# EAGLE design battiny_power_module (EAGLE 9.6.2)
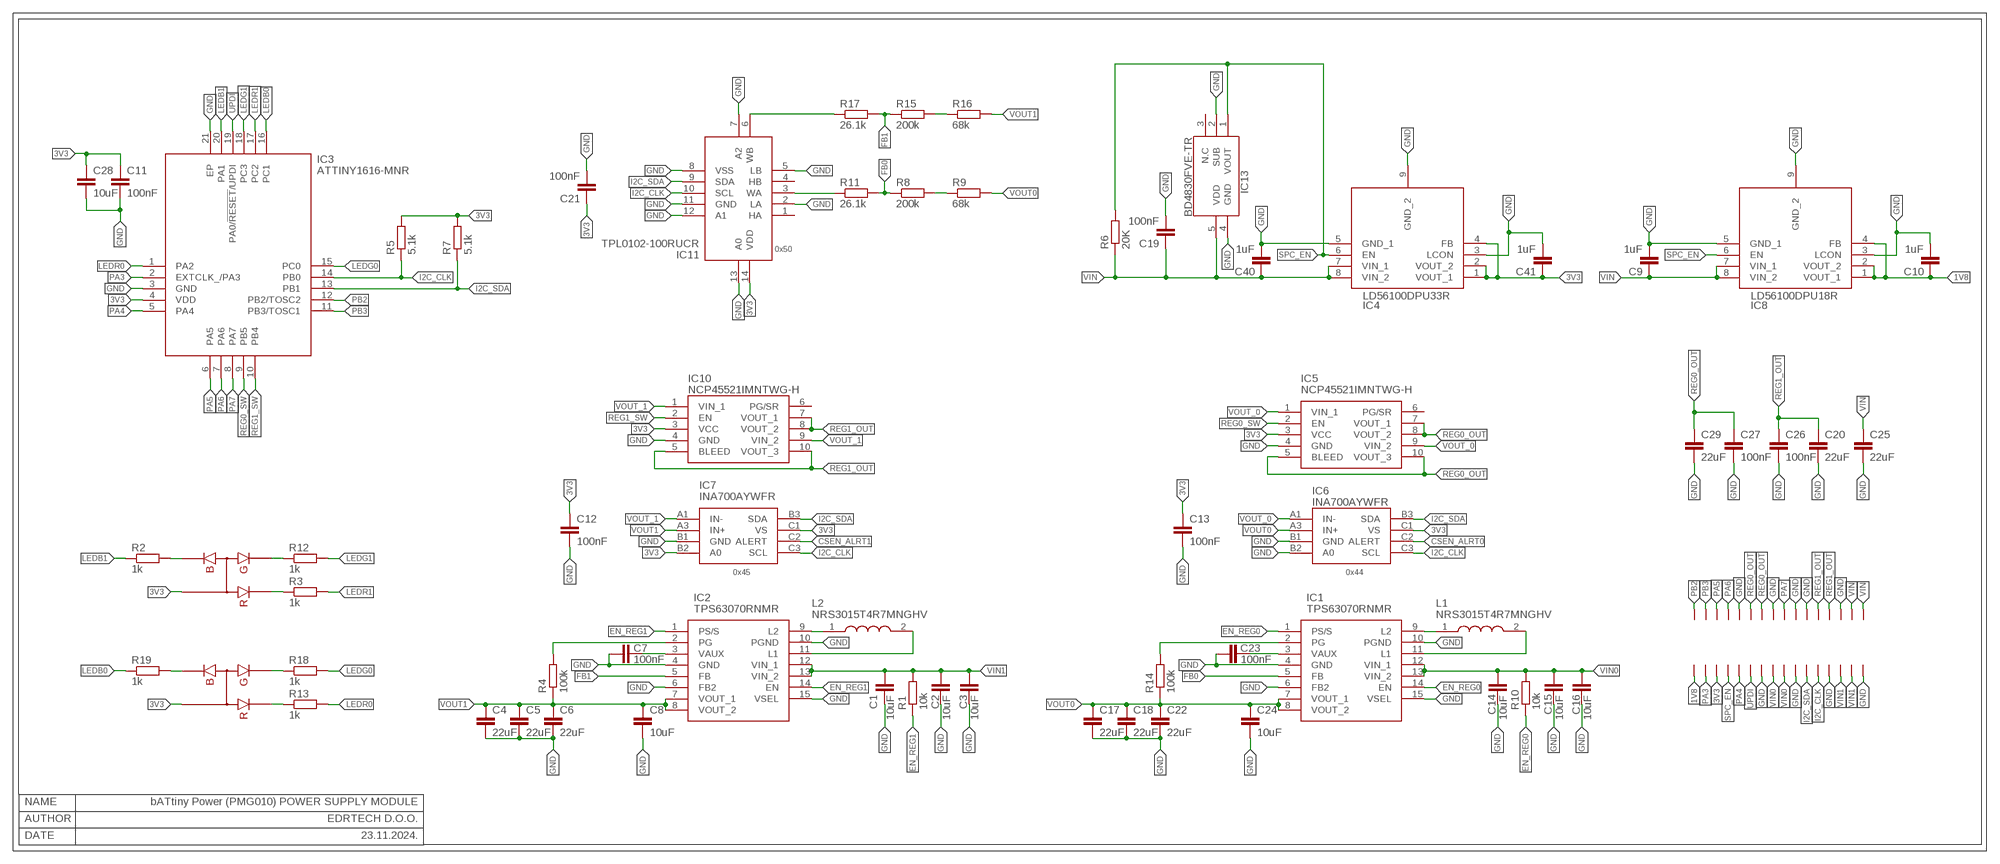
[diagram p0: schematic, sheet 1]

## Parts
C1  10uF  C-EUC0402  [C0402]
C2  10uF  C-EUC0402  [C0402]
C3  10uF  C-EUC0402  [C0402]
C4  22uF  C-EUC0603  [C0603]
C5  22uF  C-EUC0603  [C0603]
C6  22uF  C-EUC0603  [C0603]
C7  100nF  C-EUHPC0201  [HPC0201]
C8  10uF  C-EUC0402  [C0402]
C9  1uF  C-EUC0201  [C0201]
C10  1uF  C-EUC0201  [C0201]
C11  100nF  C-EUC0201  [C0201]
C12  100nF  C-EUC0201  [C0201]
C13  100nF  C-EUC0201  [C0201]
C14  10uF  C-EUC0402  [C0402]
C15  10uF  C-EUC0402  [C0402]
C16  10uF  C-EUC0402  [C0402]
C17  22uF  C-EUC0603  [C0603]
C18  22uF  C-EUC0603  [C0603]
C19  100nF  C-EUC0201  [C0201]
C20  22uF  C-EUC0805K  [C0805K]
C21  100nF  C-EUC0201  [C0201]
C22  22uF  C-EUC0603  [C0603]
C23  100nF  C-EUHPC0201  [HPC0201]
C24  10uF  C-EUC0402  [C0402]
C25  22uF  C-EUC0805K  [C0805K]
C26  100nF  C-EUC0603  [C0603]
C27  100nF  C-EUC0603  [C0603]
C28  10uF  C-EUC0402  [C0402]
C29  22uF  C-EUC0805K  [C0805K]
C40  1uF  C-EUC0201  [C0201]
C41  1uF  C-EUC0201  [C0201]
IC1  TPS63070RNMR  [TPS630701RNMR]
IC2  TPS63070RNMR  [TPS630701RNMR]
IC3  ATTINY1616-MNR  [QFN40P300X300X90-21N]
IC4  LD56100DPU30R  [SON40P120X160X50-9N]
IC5  NCP45521IMNTWG-H  [NCP45521]
IC6  INA700AYWFR  [INA700AYWFR]
IC7  INA700AYWFR  [INA700AYWFR]
IC8  LD56100DPU30R  [SON40P120X160X50-9N]
IC10  NCP45521IMNTWG-H  [NCP45521]
IC11  TPL0102-100RUCR  [QFN40P200X200X40-14N]
IC13  BD4830FVE-TR  [SOTFL50P160X60-5N]
L1  NRS3015T4R7MNGHV  [NRS3015T4R7MNGHV]
L2  NRS3015T4R7MNGHV  [NRS3015T4R7MNGHV]
R1  10k  R-EU_R0201  [R0201]
R2  1k  R-EU_R0201  [R0201]
R3  1k  R-EU_R0201  [R0201]
R4  100k  R-EU_R0201  [R0201]
R5  5.1k  R-EU_R0201  [R0201]
R6  20K  R-EU_R0201  [R0201]
R7  5.1k  R-EU_R0201  [R0201]
R8  200k  R-EU_R0201  [R0201]
R9  68k  R-EU_R0201  [R0201]
R10  10k  R-EU_R0201  [R0201]
R11  26.1k  R-EU_R0201  [R0201]
R12  1k  R-EU_R0201  [R0201]
R13  1k  R-EU_R0201  [R0201]
R14  100k  R-EU_R0201  [R0201]
R15  200k  R-EU_R0201  [R0201]
R16  68k  R-EU_R0201  [R0201]
R17  26.1k  R-EU_R0201  [R0201]
R18  1k  R-EU_R0201  [R0201]
R19  1k  R-EU_R0201  [R0201]
U$1  1.27_CH_16P  [1.27_CH_16P]
U$2  1.27_CH_16P  [1.27_CH_16P]
U$3  XL-B1010RGBT-HF  [TBA-C1010MB-J2I16]
U$4  XL-B1010RGBT-HF  [TBA-C1010MB-J2I16]

## Nets
1V8: C10.1 IC8.1(VOUT_1) IC8.2(VOUT_2) IC8.4(FB) U$2.P$32 U$2.P$48
3V3: C11.1 C12.1 C13.1 C21.1 C28.1 C41.1 IC3.4(VDD) IC4.1(VOUT_1) IC4.2(VOUT_2) IC4.4(FB) IC5.3(VCC) IC6.C1(VS) IC7.B2(A0) IC7.C1(VS) IC10.3(VCC) IC11.14(VDD) R5.2 R7.2 U$2.P$30 U$2.P$46 U$3.P$3 U$4.P$3
CSEN_ALRT0: IC6.C2(ALERT)
CSEN_ALRT1: IC7.C2(ALERT)
EN_REG0: IC1.1(PS/S) IC1.14(EN) R10.1
EN_REG1: IC2.1(PS/S) IC2.14(EN) R1.1
FB0: IC1.5(FB) R8.1 R11.2
FB1: IC2.5(FB) R15.1 R17.2
GND: C1.2 C2.2 C3.2 C4.2 C5.2 C6.2 C7.1 C8.2 C9.2 C10.2 C11.2 C12.2 C13.2 C14.2 C15.2 C16.2 C17.2 C18.2 C19.2 C20.2 C21.2 C22.2 C23.1 C24.2 C25.2 C26.2 C27.2 C28.2 C29.2 C40.2 C41.2 IC1.4(GND) IC1.6(FB2) IC1.10(PGND) IC1.15(VSEL) IC2.4(GND) IC2.6(FB2) IC2.10(PGND) IC2.15(VSEL) IC3.3(GND) IC3.21(EP) IC4.3(LCON) IC4.5(GND_1) IC4.9(GND_2) IC5.4(GND) IC6.B1(GND) IC6.B2(A0) IC7.B1(GND) IC8.3(LCON) IC8.5(GND_1) IC8.9(GND_2) IC10.4(GND) IC11.2(LA) IC11.5(LB) IC11.7(A2) IC11.8(VSS) IC11.11(GND) IC11.12(A1) IC11.13(A0) IC13.2(SUB) IC13.4(GND) U$1.P$21 U$1.P$24 U$1.P$26 U$1.P$27 U$1.P$30 U$1.P$37 U$1.P$40 U$1.P$42 U$1.P$43 U$1.P$46 U$2.P$17 U$2.P$20 U$2.P$23 U$2.P$26 U$2.P$33 U$2.P$36 U$2.P$39 U$2.P$42
I2C_CLK: IC3.14(PB0) IC6.C3(SCL) IC7.C3(SCL) IC11.10(SCL) R5.1 U$2.P$21 U$2.P$37
I2C_SDA: IC3.13(PB1) IC6.B3(SDA) IC7.B3(SDA) IC11.9(SDA) R7.1 U$2.P$22 U$2.P$38
LEDB0: IC3.16(PC1) R19.1
LEDB1: IC3.20(PA1) R2.1
LEDG0: IC3.15(PC0) R18.2
LEDG1: IC3.18(PC3) R12.2
LEDR0: IC3.1(PA2) R13.2
LEDR1: IC3.17(PC2) R3.2
N$1: IC2.9(L2) L2.1
N$2: IC2.11(L1) L2.2
N$4: C7.2 IC2.3(VAUX)
N$5: R8.2 R9.1
N$6: IC2.2(PG) R4.2
N$7: R2.2 U$4.P$1
N$8: R15.2 R16.1
N$10: IC1.9(L2) L1.1
N$11: R3.1 U$4.P$4
N$12: IC1.11(L1) L1.2
N$26: C23.2 IC1.3(VAUX)
N$27: IC1.2(PG) R14.2
N$36: R12.1 U$4.P$2
N$46: R13.1 U$3.P$4
N$47: R18.1 U$3.P$2
N$48: R19.2 U$3.P$1
N$54: IC11.6(WB) R17.1
N$57: IC11.3(WA) R11.1
PA3: IC3.2(EXTCLK_/PA3) U$2.P$31 U$2.P$47
PA4: IC3.5(PA4) U$2.P$28 U$2.P$44
PA5: IC3.6(PA5) U$1.P$19 U$1.P$35
PA6: IC3.7(PA6) U$1.P$20 U$1.P$36
PA7: IC3.8(PA7) U$1.P$25 U$1.P$41
PB2: IC3.12(PB2/TOSC2) U$1.P$17 U$1.P$33
PB3: IC3.11(PB3/TOSC1) U$1.P$18 U$1.P$34
REG0_OUT: C27.1 C29.1 IC5.5(BLEED) IC5.7(VOUT_1) IC5.8(VOUT_2) IC5.10(VOUT_3) U$1.P$22 U$1.P$23 U$1.P$38 U$1.P$39
REG0_SW: IC3.9(PB5) IC5.2(EN)
REG1_OUT: C20.1 C26.1 IC10.5(BLEED) IC10.7(VOUT_1) IC10.8(VOUT_2) IC10.10(VOUT_3) U$1.P$28 U$1.P$29 U$1.P$44 U$1.P$45
REG1_SW: IC3.10(PB4) IC10.2(EN)
SPC_EN: IC4.6(EN) IC8.6(EN) IC13.1(VOUT) R6.2 U$2.P$29 U$2.P$45
UPDI: IC3.19(PA0/!RESET!/UPDI) U$2.P$27 U$2.P$43
VIN: C9.1 C19.1 C25.1 C40.1 IC4.7(VIN_1) IC4.8(VIN_2) IC8.7(VIN_1) IC8.8(VIN_2) IC13.5(VDD) R6.1 U$1.P$31 U$1.P$32 U$1.P$47 U$1.P$48
VIN0: C14.1 C15.1 C16.1 IC1.12(VIN_1) IC1.13(VIN_2) R10.2 U$2.P$24 U$2.P$25 U$2.P$40 U$2.P$41
VIN1: C1.1 C2.1 C3.1 IC2.12(VIN_1) IC2.13(VIN_2) R1.2 U$2.P$18 U$2.P$19 U$2.P$34 U$2.P$35
VOUT0: C17.1 C18.1 C22.1 C24.1 IC1.7(VOUT_1) IC1.8(VOUT_2) IC6.A3(IN+) R9.2 R14.1
VOUT1: C4.1 C5.1 C6.1 C8.1 IC2.7(VOUT_1) IC2.8(VOUT_2) IC7.A3(IN+) R4.1 R16.2
VOUT_0: IC5.1(VIN_1) IC5.9(VIN_2) IC6.A1(IN-)
VOUT_1: IC7.A1(IN-) IC10.1(VIN_1) IC10.9(VIN_2)
Unconnected: IC5.6(PG/SR) IC10.6(PG/SR) IC11.1(HA) IC11.4(HB) IC13.3(N.C)

## Notes on the sheet
- 0x50
- LD56100DPU33R | LD56100DPU18R
- 0x45 | 0x44
- NAME | bATtiny Power (PMG010) POWER SUPPLY MODULE
- AUTHOR | EDRTECH D.O.O.
- DATE | 23.11.2024.

## Library data of the parts
C1-C29 C40 C41 = rcl:C-EU: CAPACITOR, European symbol; SPICEPREFIX: C
IC1 IC2 = edrtech_lib:TPS63070RNMR: Wide Input Voltage (2V-16V) Buck-Boost Converter Source: Datasheet <http://www.ti.com/lit/gpn/tps63070>; ARROW_PART_NUMBER: TPS63070RNMR; ARROW_PRICE-STOCK: https://www.arrow.com/en/products/tps63070rnmr/texas-instruments?region=nac; DESCRIPTION: Wide Input Voltage (2V-16V) Buck-Boost Converter; HEIGHT: mm; MANUFACTURER_NAME: Texas Instruments; MANUFACTURER_PART_NUMBER: TPS63070RNMR; MOUSER_PART_NUMBER: 595-TPS63070RNMR; MOUSER_PRICE-STOCK: https://www.mouser.co.uk/ProductDetail/Texas-Instruments/TPS63070RNMR?qs=LuYMPh7GGMS51GHntBDRnQ%3D%3D
IC3 = edrtech_lib:ATTINY1616-MNR: Microchip ATTINY1616-MNR, 8bit AVR Microcontroller, 20MHz, 16 kB Flash, 20-Pin VQFN Source: Datasheet <https://datasheet.datasheetarchive.com/originals/distributors/DKDS41/DSANUWW0026757.pdf>; ARROW_PART_NUMBER: ATTINY1616-MNR; ARROW_PRICE-STOCK: https://www.arrow.com/en/products/attiny1616-mnr/microchip-technology?region=nac; DESCRIPTION: Microchip ATTINY1616-MNR, 8bit AVR Microcontroller, 20MHz, 16 kB Flash, 20-Pin VQFN; HEIGHT: 0.9mm; MANUFACTURER_NAME: Microchip; MANUFACTURER_PART_NUMBER: ATTINY1616-MNR; MOUSER_PART_NUMBER: 556-ATTINY1616MNR; MOUSER_PRICE-STOCK: https://www.mouser.co.uk/ProductDetail/Microchip-Technology/ATTINY1616-MNR?qs=HXFqYaX1Q2yKNpuKQU9qww%3D%3D
IC4 IC8 = edrtech_lib:LD56100DPU30R: LDO Voltage Regulators POWER MANAGEMENT Source: Datasheet <https://componentsearchengine.com/Datasheets/1/LD56100DPU30R.pdf>; ARROW_PART_NUMBER: LD56100DPU30R; ARROW_PRICE-STOCK: https://www.arrow.com/en/products/ld56100dpu30r/stmicroelectronics?region=nac; DESCRIPTION: LDO Voltage Regulators POWER MANAGEMENT; HEIGHT: 0.5mm; MANUFACTURER_NAME: STMicroelectronics; MANUFACTURER_PART_NUMBER: LD56100DPU30R; MOUSER_PART_NUMBER: 511-LD56100DPU30R; MOUSER_PRICE-STOCK: https://www.mouser.co.uk/ProductDetail/STMicroelectronics/LD56100DPU30R?qs=rrS6PyfT74cpfJYuxhTQmg%3D%3D
IC5 IC10 = edrtech_lib:NCP45521IMNTWG-H: ON Semiconductor NCP45521IMNTWG-H, 1 Power Switch IC, High Side 8-Pin, DFN Source: Datasheet <http://www.onsemi.com/pub/Collateral/NCP45520-D.PDF>; ARROW_PART_NUMBER: NCP45521IMNTWG-H; ARROW_PRICE-STOCK: https://www.arrow.com/en/products/ncp45521imntwg-h/on-semiconductor?region=nac; DESCRIPTION: ON Semiconductor NCP45521IMNTWG-H, 1 Power Switch IC, High Side 8-Pin, DFN; HEIGHT: 1mm; MANUFACTURER_NAME: onsemi; MANUFACTURER_PART_NUMBER: NCP45521IMNTWG-H; MOUSER_PART_NUMBER: 863-NCP45521IMNTWG-H; MOUSER_PRICE-STOCK: https://www.mouser.co.uk/ProductDetail/onsemi/NCP45521IMNTWG-H?qs=72ObqG5T4UZ6w73ghQANGg%3D%3D
IC6 IC7 = edrtech_lib:INA700AYWFR: Current & Power Monitors & Regulators 40-V16-BitIC output digital power monitor in WCSP withEZShunt Technology 8-DSBGA -40 to 125 Source: Datasheet <https://www.ti.com/lit/ds/symlink/ina700.pdf?ts=1715161211623&ref_url=https%3A%2F%2Fwww.ti.com%2Fproduct%2FINA700%2Fpart-details%2FINA700AYWFR>; DESCRIPTION: Current & Power Monitors & Regulators 40-V16-BitIC output digital power monitor in WCSP withEZShunt Technology 8-DSBGA -40 to 125; HEIGHT: 0.3mm; MANUFACTURER_NAME: Texas Instruments; MANUFACTURER_PART_NUMBER: INA700AYWFR
IC11 = edrtech_lib:TPL0102-100RUCR: 256-Taps Dual-Channel Digital Potentiometer With I2C Interface and Nonvolatile Memory Source: Datasheet <http://www.ti.com/lit/ds/symlink/tpl0102-100.pdf>; ARROW_PART_NUMBER: TPL0102-100RUCR; ARROW_PRICE-STOCK: https://www.arrow.com/en/products/tpl0102-100rucr/texas-instruments?region=nac; DESCRIPTION: 256-Taps Dual-Channel Digital Potentiometer With I2C Interface and Nonvolatile Memory; HEIGHT: 0.4mm; MANUFACTURER_NAME: Texas Instruments; MANUFACTURER_PART_NUMBER: TPL0102-100RUCR
IC13 = BD4830FVE-TR:BD4830FVE-TR: ROHM BD4830FVE-TR, Voltage Detector 5-Pin, VSOF Source: Datasheet <https://componentsearchengine.com/Datasheets/1/BD4830FVE-TR.pdf>; DESCRIPTION: ROHM BD4830FVE-TR, Voltage Detector 5-Pin, VSOF; HEIGHT: 0.6mm; MANUFACTURER_NAME: ROHM Semiconductor; MANUFACTURER_PART_NUMBER: BD4830FVE-TR; MOUSER_PART_NUMBER: 755-BD4830FVE-TR; MOUSER_PRICE-STOCK: https://www.mouser.co.uk/ProductDetail/ROHM-Semiconductor/BD4830FVE-TR?qs=4kLU8WoGk0tBHsO2oOYuSw%3D%3D
L1 L2 = edrtech_lib:NRS3015T4R7MNGHV: Fixed Inductors 3015 4.7uH 144mOhms +/-20%Tol 1.02A Q200 Source: Datasheet <https://datasheet.datasheetarchive.com/originals/distributors/Datasheets-DGA11/2208534.pdf>; ARROW_PART_NUMBER: NRS3015T4R7MNGHV; ARROW_PRICE-STOCK: null?region=nac; DESCRIPTION: Fixed Inductors 3015 4.7uH 144mOhms +/-20%Tol 1.02A Q200; HEIGHT: 1.5mm; MANUFACTURER_NAME: TAIYO YUDEN; MANUFACTURER_PART_NUMBER: NRS3015T4R7MNGHV; MOUSER_PART_NUMBER: 963-NRS3015T4R7MNGHV; MOUSER_PRICE-STOCK: https://www.mouser.co.uk/ProductDetail/TAIYO-YUDEN/NRS3015T4R7MNGHV?qs=DpxmIIQLg%252BO42hcBUV1Thg%3D%3D
R1-R19 = rcl:R-EU_: RESISTOR, European symbol; SPICEPREFIX: R
U$1 U$2 = edrtech_lib:1.27_CH_16P
U$3 U$4 = edrtech_lib:XL-B1010RGBT-HF

## Board
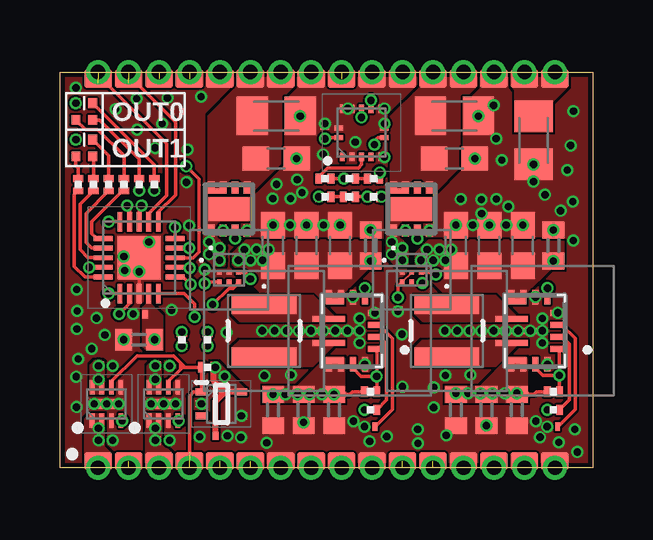
[diagram p1: board, top side]
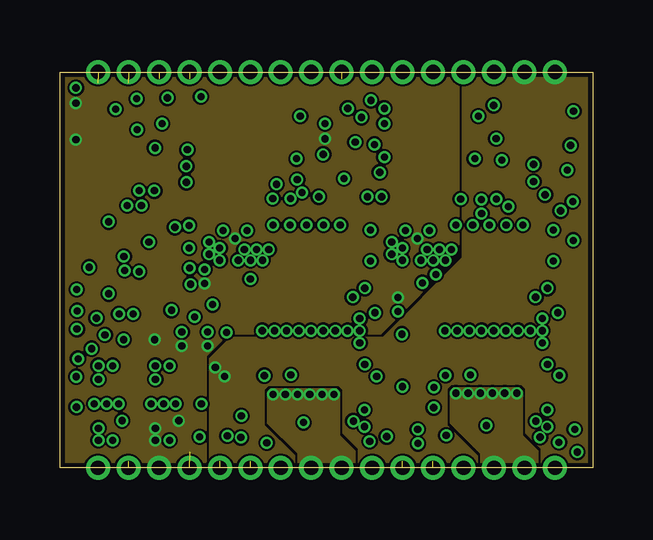
[diagram p2: board, inner layer Route2]
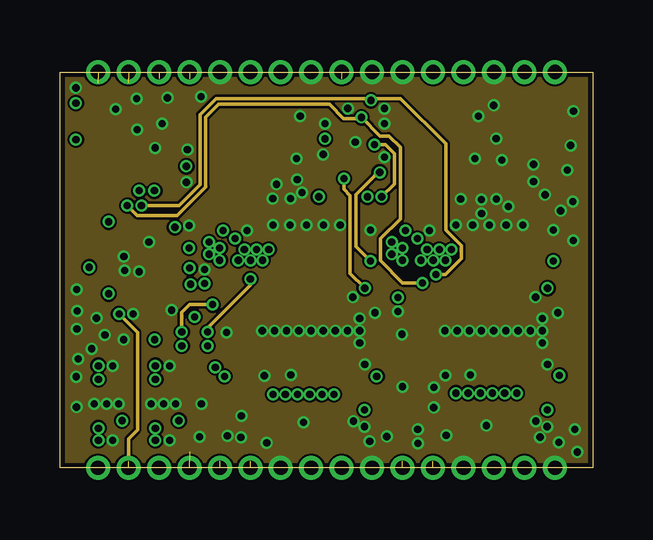
[diagram p3: board, inner layer Route3]
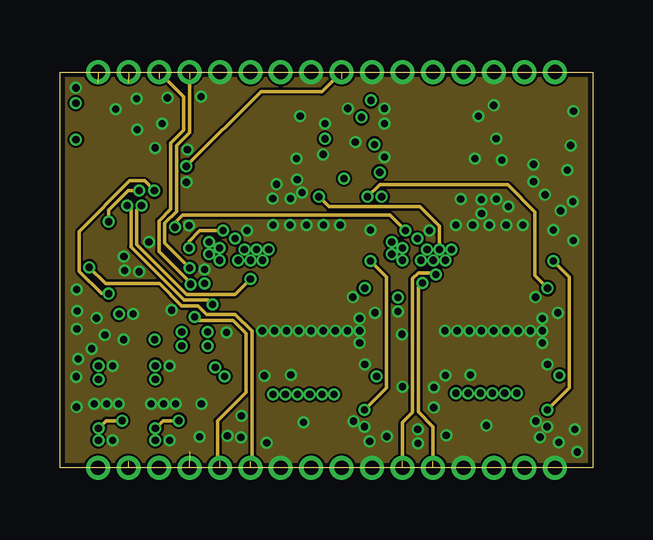
[diagram p4: board, inner layer Route14]
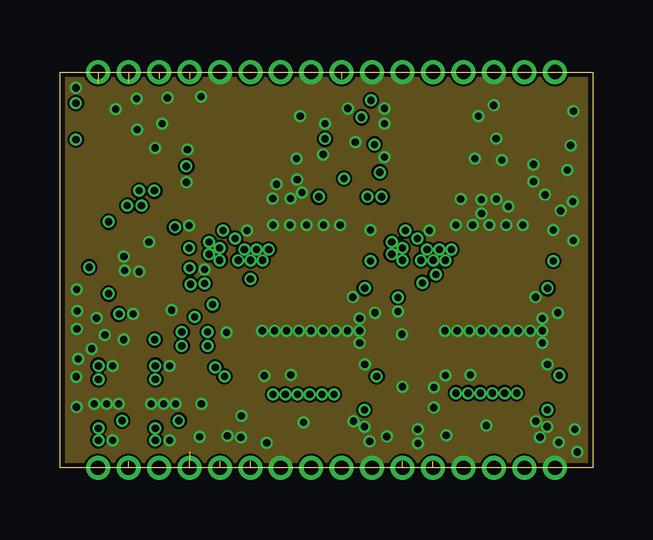
[diagram p5: board, inner layer Route15]
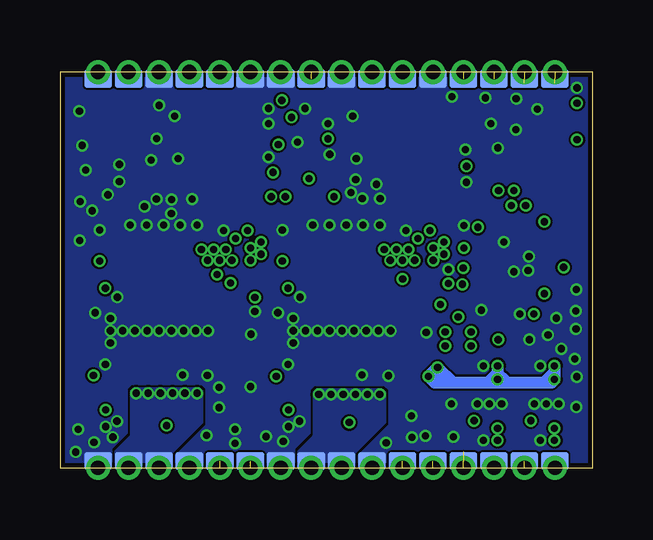
[diagram p6: board, bottom side, seen from below]

Size 22.23 x 16.51 mm. Coordinates in mm from the lower left corner, seen from the top.
Outline: 0,0 0,16.51 22.23,16.51 22.23,0 0,0
Copper layers (1+2*3+14*15+16): Top 0.035mm / dielectric 0.0994mm / Route2 0.0152mm / dielectric 0.55mm / Route3 0.0152mm / dielectric 0.1088mm / Route14 0.0152mm / dielectric 0.55mm / Route15 0.0152mm / dielectric 0.0994mm / Bottom 0.035mm
Design rules "jlcpcb-6layers_edrtech *": minimum track width 3.5mil, minimum drill 0.2mm, track to track 3.5mil, track to pad 3.5mil, pad to pad 3.5mil, via to via 3.5mil, smd to smd 0mil, copper to edge 0.2mm, drill to drill 6mil, minimum pad ring 0.1mm, minimum via ring 0.1mm, stop-mask expansion 2mil, vias tented up to drill 25mil, thermal gap 10mil

### Footprints (pad centres in the part's own frame; a part is rotated, then mirrored left to right if it is on the bottom)
C0402 = smd 0.7 x 0.9: 1 -0.65,0; 2 0.65,0
C0603 = smd 1.1 x 1: 1 -0.85,0; 2 0.85,0
HPC0201 = smd 0.2 x 0.35: 1 -0.18,0; 2 0.18,0
C0201 = smd 0.25 x 0.35: 1 -0.25,0; 2 0.25,0
C0805K = smd 1.3 x 1.6: 1 -1,0; 2 1,0
TPS630701RNMR = smd 0.6 x 0.25: 1 -0.438,0.75; 2 -0.438,0.25; 3 -0.438,-0.25; 4 -0.438,-0.75 | smd 0.25 x 0.6: 5 -0.012,-1.4; 6 0.488,-1.4; 7 0.988,-1.4; 8 1.488,-1.4; 12 1.488,1.4; 13 0.988,1.4; 14 0.488,1.4; 15 -0.012,1.4 | smd 1.35 x 0.25: 9 1.488,-0.5; 11 1.488,0.5 | smd 1.7 x 0.25: 10 1.313,0 | smd 0.25 x 0.25: 16 1.238,1.225; 17 1.238,-1.225
QFN40P300X300X90-21N = smd 0.8 x 0.2: 1 -1.5,0.8; 2 -1.5,0.4; 3 -1.5,0; 4 -1.5,-0.4; 5 -1.5,-0.8; 11 1.5,-0.8; 12 1.5,-0.4; 13 1.5,0; 14 1.5,0.4; 15 1.5,0.8 | smd 0.2 x 0.8: 6 -0.8,-1.5; 7 -0.4,-1.5; 8 0,-1.5; 9 0.4,-1.5; 10 0.8,-1.5; 16 0.8,1.5; 17 0.4,1.5; 18 0,1.5; 19 -0.4,1.5; 20 -0.8,1.5 | smd 1.8 x 1.8: 21 0,0
SON40P120X160X50-9N = smd 0.6 x 0.2: 1 -0.7,0.6; 2 -0.7,0.2; 3 -0.7,-0.2; 4 -0.7,-0.6; 5 0.7,-0.6; 6 0.7,-0.2; 7 0.7,0.2; 8 0.7,0.6 | smd 0.4 x 1.4: 9 0,0
NCP45521 = smd 0.3 x 0.5: 1 -0.75,-0.9; 2 -0.25,-0.9; 3 0.25,-0.9; 4 0.75,-0.9; 5 0.75,0.9; 6 0.25,0.9; 7 -0.25,0.9; 8 -0.75,0.9 | smd 1.7 x 1: 9 0,0 | smd 0.195 x 0.2: 10 -0.5,0.75
INA700AYWFR = smd 0.3 x 0.404: A1 -0.387,0.4; A3 0.387,0.4 | smd 0.2 x 0.2: B1 -0.4,-0.102; B2 0,-0.102; B3 0.4,-0.102; C1 -0.4,-0.502; C2 0,-0.502; C3 0.4,-0.502
QFN40P200X200X40-14N = smd 0.35 x 0.2: 1 -1,0.8; 2 -1,0.4; 3 -1,0; 4 -1,-0.4; 5 -1,-0.8; 8 1,-0.8; 9 1,-0.4; 10 1,0; 11 1,0.4; 12 1,0.8 | smd 0.2 x 0.35: 6 -0.2,-0.95; 7 0.2,-0.95; 13 0.2,0.95; 14 -0.2,0.95
SOTFL50P160X60-5N = smd 0.465 x 0.3: 1 -0.832,0.5; 2 -0.832,0; 3 -0.832,-0.5; 4 0.832,-0.5; 5 0.832,0.5
NRS3015T4R7MNGHV = smd 0.8 x 2.7: 1 -1.1,0; 2 1.1,0
R0201 = smd 0.28 x 0.43: 1 -0.255,0; 2 0.255,0
1.27_CH_16P = smd 1.15 x 0.762: P$17 -9.525,-0.279; P$18 -8.255,-0.279; P$19 -6.985,-0.279; P$20 -5.715,-0.279; P$21 -4.445,-0.279; P$22 -3.175,-0.279; P$23 -1.905,-0.279; P$24 -0.635,-0.279; P$25 0.635,-0.279; P$26 1.905,-0.279; P$27 3.175,-0.279; P$28 4.445,-0.279; P$29 5.715,-0.279; P$30 6.985,-0.279; P$31 8.255,-0.279; P$32 9.525,-0.279 | smd 1.15 x 0.762 bottom: P$33 -9.525,-0.279; P$34 -8.255,-0.279; P$35 -6.985,-0.279; P$36 -5.715,-0.279; P$37 -4.445,-0.279; P$38 -3.175,-0.279; P$39 -1.905,-0.279; P$40 -0.635,-0.279; P$41 0.635,-0.279; P$42 1.905,-0.279; P$43 3.175,-0.279; P$44 4.445,-0.279; P$45 5.715,-0.279; P$46 6.985,-0.279; P$47 8.255,-0.279; P$48 9.525,-0.279
TBA-C1010MB-J2I16 = smd 0.4 x 0.4: P$1 -0.35,0.35; P$2 -0.35,-0.35; P$3 0.35,0.35; P$4 0.35,-0.35

### Placement (x,y rotation side)
C1  16.51,2.41 270 top
C2  17.78,2.41 270 top
C3  19.05,2.41 270 top
C4  16.51,9.27 90 top
C5  19.3,9.27 90 top
C6  17.91,9.27 90 top
C7  20.57,1.71 0 top
C8  20.57,9.27 90 top
C9  1.94,4.25 0 top
C10  1.94,1.14 0 top
C11  3.3,6.41 180 top
C12  14.1,6.86 270 top
C13  6.03,7.94 90 top
C14  8.89,2.41 270 top
C15  10.16,2.41 270 top
C16  11.43,2.41 270 top
C17  10.29,9.27 90 top
C18  8.89,9.27 90 top
C19  6.73,1.33 0 top
C20  16.45,14.67 0 top
C21  11.05,13.97 90 top
C22  11.68,9.27 90 top
C23  12.95,1.71 0 top
C24  12.95,9.27 90 top
C25  19.75,13.65 270 top
C26  16.45,12.89 0 top
C27  9.02,12.89 0 top
C28  3.3,5.35 180 top
C29  9.02,14.67 0 top
C40  4.32,4.25 0 top
C41  4.32,1.14 0 top
IC1  12.7,5.71 180 top
IC2  20.32,5.71 180 top
IC3  3.3,8.76 90 top
IC4  4.32,2.67 90 top
IC5  7.05,10.79 0 top
IC6  7.05,8.26 0 top
IC7  14.67,8.26 0 top
IC8  1.94,2.67 90 top
IC10  14.66,10.79 0 top
IC11  12.57,13.97 90 top
IC13  6.73,2.67 0 top
L1  8.51,5.71 270 top
L2  16.13,5.71 270 top
R1  20.57,3.17 180 top
R2  0.76,11.81 90 top
R3  2.03,11.81 270 top
R4  20.57,2.41 0 top
R5  5.08,5.33 270 top
R6  6.16,4.19 180 top
R7  6.16,5.33 270 top
R8  12.06,12.06 0 top
R9  13.08,12.06 0 top
R10  12.95,3.17 180 top
R11  11.05,12.06 0 top
R12  1.4,11.81 270 top
R13  3.94,11.81 270 top
R14  12.95,2.41 0 top
R15  12.06,11.3 180 top
R16  11.05,11.3 180 top
R17  13.08,11.3 180 top
R18  3.3,11.81 270 top
R19  2.67,11.81 90 top
U$1  11.11,16.51 0 top
U$2  11.11,0 180 top
U$3  1.02,14.86 90 top
U$4  1.02,13.34 90 top

### Tracks (layer width: path | path; a pad name or v marks a point on that pad's centre or on a via)
1V8  (via drill 0.3 pad 0.4, 0.6 pad 1)
  Top 0.152: C10.1 v1.6,1.14 | IC8.4 v2.59,1.97
  Route14 0.152: v2.59,1.97 1.92,1.97 v1.6,1.65
  other vias: 1.59,0
  pour Top (no thermals): 1.24,2.27 1.01,2.04 1.01,0 2.16,0 2.16,0.6 1.85,0.9 1.85,2.27
3V3  (via drill 0.3 pad 0.4, 0.6 pad 1)
  Top 0.102: IC7.B2 IC7.C1
  Top 0.152: C41.1 v3.98,1.14 | IC4.4 v4.96,1.97 | IC5.3 v7.3,9.56 | IC10.3 v14.91,9.56 | IC7.C1 14.1,7.58 C12.1 | C13.1 6.1,7.75 IC6.C1 | IC11.14 11.1,13.77 C21.1
  Route14 0.152: v4.96,1.97 4.29,1.97 v3.98,1.65
  other vias: 3.95,5.35 6.16,5.08 5.08,5.08 6.03,7.69 14.1,7.11 11.05,13.72 0.67,15.21 0.67,13.69 4.13,0
  pour Top (no thermals): 3.61,2.29 4.22,2.29 4.27,2.24 4.27,1.04 4.7,0.61 4.7,0.58 4.72,0.56 4.72,0 3.56,0 3.56,2.24
  pour Route2 (rank 6, no thermals): 0,0 0,16.51 22.23,16.51 22.23,0
  pour Top (no thermals): 3.6,4.9 3.43,5.07 3.43,6.69 3.6,6.86 3.6,7.66 3.8,7.66 3.8,6.86 4.3,6.36 4.3,4.9
EN_REG0  (via drill 0.3 pad 0.4)
  Top 0.152: IC1.14 12.21,4.16 12.56,3.81 v13.21,3.81 | v13.21,3.81 R10.1 | IC1.1 13.21,4.89 v13.21,3.81
EN_REG1  (via drill 0.3 pad 0.4)
  Top 0.152: IC2.14 19.83,4.16 20.14,3.85 v20.83,3.85 | v20.83,3.85 R1.1 | v20.83,3.85 20.83,4.89 IC2.1
FB0  (via drill 0.3 pad 0.4)
  Top 0.152: IC1.5 v12.71,7.49 | v11.84,12.06 R8.1 R11.2
  Route3 0.152: v12.71,7.49 12.1,8.11 12.1,11.36 11.84,11.62 v11.84,12.06
FB1  (via drill 0.3 pad 0.4)
  Top 0.152: R15.1 R17.2 | IC2.5 v20.33,7.49
  Route14 0.152: v20.33,7.49 19.81,8.01 19.81,10.67 18.67,11.81 13.34,11.81 R17.2
  other vias: 12.83,11.3
GND  (via drill 0.3 pad 0.4, 0.6 pad 1)
  Top 0.152: IC3.3 IC3.21 | C12.2 v14.1,6.52 | C13.2 v6.03,8.28 | IC1.10 v12.5,5.71 | C7.1 v20.32,1.71 | C23.1 v12.7,1.71
  other vias: 3.05,6.41 2.65,5.35 10.02,14.67 9.87,12.89 11.05,14.35 12,14.99 13.53,14.35 13.53,14.99 13.53,12.95 17.45,14.67 17.3,12.89 19.75,12.65 7.8,9.89 8.89,10.12 10.29,10.12 11.68,10.12 12.95,9.92 15.41,9.89 16.51,10.12 17.91,10.12 19.3,10.12 20.57,9.92 12.21,7.12 13.14,6.46 12.71,4.32 11.99,5.71 11.48,5.71 10.98,5.71 10.47,5.71 20.12,5.71 19.61,5.71 19.1,5.71 18.6,5.71 18.09,5.71 20.33,4.32 20.76,6.46 19.83,7.12 17.78,1.76 10.16,1.89 6.98,1.33 7.56,2.17 5.9,2.67 4.57,4.25 2.2,4.25 2.19,1.14 4.57,1.14 1.94,2.67 4.32,2.67 1.43,2.67 2.45,2.67 3.81,2.67 4.82,2.67 9.59,10.12 10.99,10.12 17.21,10.12 18.61,10.12 13.02,0 16.83,0 20.64,0 18.1,16.51 2.32,14.96 3.96,13.34 3.2,15.39 4.26,14.36 6.67,16.51 10.48,16.51 13.02,16.51 14.29,16.51 9.21,0 0.66,15.85 5.27,11.91 5.38,10.11 3.71,9.42 2.66,8.81 2.7,8.23 3.3,8.18 3.21,14.11 5.88,15.48 5.31,13.27 8.87,11.22 9.62,11.23 9.89,12.02 9.03,11.83 10.09,11.48 12.32,13.58 10.98,13.07 4.48,15.43 0.7,7.44 0.72,6.55 0.71,5.79 1.52,6.24 4.65,6.57 1.32,4.97 0.67,3.8 0.76,4.55 0.69,2.53 5.82,1.29 8.62,1.04 7.54,1.27 12.91,1.1 14.93,1.01 14.92,1.6 13.63,1.3 15.58,2.51 15.59,3.36 14.28,3.38 14.26,5.57 20.81,1.06 21.57,0.66 21.46,1.61 21.4,9.48 21.38,11.11 20.23,11.39 21.15,12.41 21.29,13.44 21.41,14.87 18.42,12.84 18.2,11.21 17.57,11.18 18.7,10.89 19.75,11.93 20.88,10.72 18.19,13.73 18.08,15.11 16.71,11.21 9.63,3.88 8.52,3.84 17.12,3.87 16.08,3.86 16.11,1.35 19.85,1.95 20.02,1.28 12.23,1.95 6.95,5.65 1.87,5.54 17.58,10.6 20.12,5.21 20.12,6.22 12.5,5.21 12.5,6.22 9.96,5.71 9.45,5.71 8.94,5.71 8.44,5.71 17.58,5.71 17.07,5.71 16.56,5.71 16.06,5.71
  pour Top (rank 6, no thermals): 0,0 0,16.51 22.23,16.51 22.23,0
  pour Route3 (rank 6, no thermals): 0,0 0,16.51 22.23,16.51 22.23,0
  pour Route14 (rank 6, no thermals): 0,0 0,16.51 22.23,16.51 22.23,0
  pour Route15 (rank 6, no thermals): 0,0 0,16.51 22.23,16.51 22.23,0
  pour Bottom (rank 6, no thermals): 0,0 0,16.51 22.23,16.51 22.23,0
I2C_CLK  (via drill 0.3 pad 0.4, 0.6 pad 1)  (1 unrouted)
  Top 0.152: R5.1 v5.08,5.67 | v6.37,6.81 7.05,7.49 7.22,7.49 7.45,7.72 IC6.C3 | IC7.C3 v15.11,7.71 | IC11.10 v12.57,14.62 | IC3.14 2.9,10.84 v2.81,10.94
  Route3 0.152: v2.81,10.94 3.22,10.52 4.89,10.52 6.08,11.71 6.08,14.63 6.61,15.16 11.24,15.16 11.83,14.57 12.53,14.57 v12.57,14.62 13.35,13.84 13.72,13.84 14.2,13.36 14.2,10.38 13.37,9.56 13.37,8.64 14.29,7.71 v15.11,7.71 | v5.08,5.67 5.08,6.48 5.41,6.81 v6.37,6.81
  Route14 0.152: v15.11,7.71 14.95,7.55 14.95,2.33 15.56,1.71 v15.56,0 | v2.81,10.94 2.96,10.78 2.96,9.21 5.17,7 6.18,7 v6.37,6.81
I2C_SDA  (via drill 0.3 pad 0.4, 0.6 pad 1)  (1 unrouted)
  Top 0.152: R7.1 v6.16,5.67 | IC6.B3 7.74,8.15 7.94,7.95 v7.94,7.87 | IC7.B3 15.58,8.15 v15.67,8.07 | IC11.9 v12.97,15.32 | IC3.13 3.3,10.84 v3.4,10.94
  Route3 0.152: v3.4,10.94 4.97,10.94 5.84,11.81 5.84,14.73 6.51,15.4 12.9,15.4 v12.97,15.32 13.05,15.4 14.21,15.4 16.09,13.51 16.09,9.92 16.74,9.27 16.74,8.74 16.07,8.07 v15.67,8.07 | v6.16,5.67 6.16,5.84 7.94,7.62 v7.94,7.87
  Route14 0.152: v7.94,7.87 7.3,7.24 5.27,7.24 3.21,9.3 3.21,10.75 v3.4,10.94 | v15.67,8.07 15.61,8.13 14.94,8.13 14.7,7.89 14.7,2.31 14.29,1.9 v14.29,0
LEDB0
  Top 0.152: IC3.16 1.54,9.56 1.33,9.78 1.33,10.26 2.62,11.56 R19.1
LEDB1
  Top 0.152: IC3.20 1.41,7.96 1.4,7.95 1.05,7.95 0.6,8.39 0.6,11.4 R2.1
LEDG0  (via drill 0.3 pad 0.4)
  Top 0.152: IC3.15 v2.03,10.26
  Route14 0.152: v2.03,10.26 2.03,10.75 2.84,11.56 R18.2
  other vias: 3.3,11.56
LEDG1
  Top 0.152: IC3.18 1.41,8.76 1.4,8.78 1.16,8.78 0.84,9.09 0.84,11 R12.2
LEDR0  (via drill 0.3 pad 0.4)
  Top 0.152: IC3.1 v2.03,7.26
  Route14 0.152: v2.03,7.26 1.74,7.26 0.81,8.19 0.81,9.86 2.92,11.97 3.52,11.97 R13.2
  other vias: 3.94,11.56
LEDR1
  Top 0.152: IC3.17 1.32,9.16 1.09,9.4 1.09,10.61 R3.2
N$1
  pour Top (no thermals): 19.49,6.09 15.11,6.09 14.78,6.42 14.78,7.22 18.18,7.22 19.06,6.34 19.49,6.34
N$2
  pour Top (no thermals): 19.49,5.34 15.1,5.34 14.78,5.02 14.78,4.21 18.18,4.21 19.06,5.09 19.49,5.09
N$4
  Top 0.152: C7.2 21.48,2.44 21.48,5.4 20.92,5.96 IC2.3
N$5
  Top 0.152: R9.1 R8.2
N$6
  Top 0.152: R4.2 21.24,2.83 21.24,5.17 20.95,5.46 IC2.2
N$7
  Top 0.152: U$4.P$1 0.67,12.61 0.76,12.51 R2.2
N$8
  Top 0.152: R15.2 R16.1
N$10
  pour Top (no thermals): 11.87,6.09 7.48,6.09 7.16,6.42 7.16,7.21 10.57,7.21 11.44,6.34 11.87,6.34
N$11
  Top 0.152: R3.1 2.03,13.02 U$4.P$4
N$12
  pour Top (no thermals): 11.89,5.34 7.48,5.34 7.16,5.01 7.16,4.22 10.56,4.22 11.43,5.09 11.89,5.09
N$26
  Top 0.152: C23.2 13.86,2.44 13.86,5.4 13.3,5.96 IC1.3
N$27
  Top 0.152: R14.2 13.62,2.83 13.62,5.17 13.33,5.46 IC1.2
N$36
  Top 0.152: R12.1 1.4,12.95 U$4.P$2
N$46
  Top 0.152: R13.1 3.94,12.64 U$3.P$4
N$47
  Top 0.152: R18.1 3.3,12.87 1.66,14.51 U$3.P$2
N$48
  Top 0.152: R19.2 2.67,13.01 1.58,14.1 1.08,14.1 U$3.P$1
N$54  (via drill 0.3 pad 0.4)
  Top 0.152: R17.1 v13.42,11.3 | v13.12,13.48 13.12,13.63 13.26,13.77 IC11.6
  Route3 0.152: v13.42,11.3 13.95,11.84 13.95,13.11 13.58,13.48 v13.12,13.48
N$57
  Top 0.152: R11.1 10.79,12.14 11.16,12.51 12.45,12.51 12.57,12.64 IC11.3
PA3  (via drill 0.3 pad 0.4, 0.6 pad 1)  (1 unrouted)
  Top 0.152: IC3.2 2.9,6.85 v2.46,6.41
  Route3 0.152: v2.46,6.41 3.24,5.64 3.24,1.59 2.86,1.21 v2.86,0
PA4  (via drill 0.3 pad 0.4, 0.6 pad 1)  (1 unrouted)
  Top 0.152: IC3.5 5.18,7.26 5.62,6.83 v5.62,6.29
  Route14 0.152: v5.62,6.29 5.76,6.15 7.21,6.15 7.76,5.6 7.76,3.15 6.57,1.96 6.57,0.1 v6.67,0
PA5  (via drill 0.3 pad 0.4, 0.6 pad 1)  (1 unrouted)
  Top 0.152: v5.44,7.65 5.13,7.96 IC3.6
  Route14 0.152: v5.44,7.65 5.44,7.71 4.13,9.03 4.13,10.3 4.61,10.78 4.61,13.54 5.16,14.09 5.16,15.48 v4.13,16.51
PA6  (via drill 0.3 pad 0.4, 0.6 pad 1)  (1 unrouted)
  Top 0.152: IC3.7 5.38,8.36 v5.41,8.33
  Route14 0.152: v5.41,8.33 4.37,9.37 4.37,10.2 4.86,10.68 4.86,13.44 5.4,13.99 v5.4,16.51
PA7  (via drill 0.3 pad 0.4, 0.6 pad 1)  (1 unrouted)
  Top 0.152: IC3.8 5.19,8.76 5.21,8.75 5.55,8.75 5.8,8.99 5.8,12.05 v5.27,12.57
  Route14 0.152: v5.27,12.57 8.38,15.68 10.92,15.68 v11.75,16.51
PB2  (via drill 0.6 pad 1)  (2 unrouted)
  Top 0.152: IC3.12 3.7,10.61 4.45,11.35 4.45,13.52 1.93,16.03 1.59,16.03
  other vias: 1.59,16.51
PB3  (via drill 0.6 pad 1)  (2 unrouted)
  Top 0.152: IC3.11 4.1,10.66 4.81,11.38 4.81,14.42 3.2,16.03 2.86,16.03
  other vias: 2.86,16.51
REG0_OUT  (via drill 0.6 pad 1)
  other vias: 9.21,16.51 7.94,16.51
  pour Top (no thermals): 6.15,11.45 6.15,14.69 7.36,15.91 7.36,16.51 9.78,16.51 9.78,15.91 9.27,15.39 9.27,12.71 8,11.44 7.65,11.44 7.65,11.85 7.5,12 7.1,12 6.95,11.85 6.95,11.45
REG0_SW  (via drill 0.3 pad 0.4)
  Top 0.152: IC3.9 v5.38,9.16
  Route14 0.152: IC5.2 5.83,9.89 5.38,9.45 v5.38,9.16
  other vias: 6.8,9.89
REG1_OUT  (via drill 0.6 pad 1)
  other vias: 16.83,16.51 15.56,16.51
  pour Top (no thermals): 13.76,11.45 13.76,14.66 14.98,15.88 14.98,16.51 17.4,16.51 17.4,15.91 16.69,15.21 16.69,12.53 15.61,11.45 15.26,11.45 15.26,11.85 15.11,12 14.71,12 14.56,11.85 14.56,11.45
REG1_SW  (via drill 0.3 pad 0.4)
  Top 0.152: v4.79,10.03 IC3.10
  Route14 0.152: v4.79,10.03 4.79,10.22 5.11,10.54 13.77,10.54 IC10.2
  other vias: 14.41,9.89
SPC_EN  (via drill 0.6 pad 1)  (2 unrouted)
  Top 0.152: IC8.6 2.14,3.6 3.21,4.67 4.74,4.67 5.03,4.38 | 5.22,4.19 R6.2 IC13.1 5.58,3.17 5.4,2.98 5.4,0.67 | 5.03,4.38 5.22,4.19 | IC4.6 4.52,3.6 5.03,4.11 | 5.22,4.19 5.11,4.19 5.03,4.11 | 5.03,4.11 5.03,4.38
  other vias: 5.4,0
UPDI  (via drill 0.3 pad 0.4, 0.6 pad 1)  (1 unrouted)
  Top 0.152: IC3.19 v1.22,8.36
  Route14 0.152: v1.22,8.36 1.91,7.68 4.15,7.68 5.08,6.75 5.75,6.75 6.11,6.39 7.31,6.39 8,5.7 8,0.06 v7.94,0
VIN  (via drill 0.3 pad 0.4, 0.6 pad 1)
  Top 0.152: C40.1 v3.98,4.25 | C9.1 v1.6,4.25
  Top 0.254: C19.1 6.48,2.77 6.72,3.01 | IC13.5 6.88,3.17 | 6.72,3.01 6.88,3.17 | 6.88,3.17 6.71,3.33 | 6.71,3.33 6.42,3.63 R6.1 | 6.71,3.33 6.71,3.02 6.72,3.01
  Bottom 0.508: v6.48,4.19 5.84,3.56 | 5.84,3.56 4.36,3.56 | 4.36,3.56 3.68,3.56 | 3.68,3.56 2.03,3.56 | 2.03,3.56 1.73,3.56 v1.6,3.68 1.6,3.94 | v1.6,4.25 1.6,3.94 | v3.98,4.25 3.98,3.94 | v3.98,3.68 3.98,3.94 | 3.98,3.94 4.36,3.56 | 3.98,3.94 3.68,3.64 3.68,3.56 | 2.03,3.56 1.65,3.94 1.6,3.94 | v6.48,4.19 v6.86,3.81 | v6.86,3.81 6.61,3.56 5.84,3.56 | v6.86,3.81 6.48,3.81 v6.48,4.19
  other vias: 20.64,16.51 19.37,16.51
  pour Top (no thermals): 18.79,16.51 18.79,15.91 18.95,15.76 18.95,14.01 20.55,14.01 20.55,15.25 21.21,15.91 21.21,16.51
  pour Top (no thermals): 1.24,3.07 1.24,4.29 1.46,4.5 1.74,4.5 1.86,4.39 1.86,3.07
  pour Top (no thermals): 3.62,3.07 3.62,4.25 3.87,4.5 4.12,4.5 4.23,4.39 4.23,3.07
  pour Route2 (rank 2, no thermals): 6.22,4.57 6.22,0 22.23,0 22.23,16.51 16.76,16.51 16.76,8.76 13.46,5.46 7.11,5.46
  pour Top (no thermals): 6.27,4.44 6.59,4.44 7.74,3.29 6.57,3.29 6.27,3.59
VIN0  (via drill 0.3 pad 0.4, 0.6 pad 1)
  Top 0.152: C16.1 11.94,3.06 | 11.94,3.06 12.08,3.06 12.19,3.17 R10.2 | 11.94,3.06 11.75,3.25 11.71,3.25 | 11.94,3.06 11.74,2.87 11.71,2.87 | IC1.12 IC1.13
  other vias: 8.89,3.06 9.4,3.06 9.91,3.06 10.41,3.06 10.92,3.06 11.43,3.06 10.48,0 11.75,0
  pour Bottom (no thermals): 9.9,0 9.9,0.6 8.64,1.86 8.64,3.17 8.79,3.32 11.53,3.32 11.68,3.17 11.68,1.35 12.32,0.71 12.32,0
  pour Top (no thermals): 8.44,2.71 8.44,3.41 9.89,3.41 11.09,4.61 11.84,4.61 11.89,4.56 11.89,2.71
  pour Route2 (no thermals): 9.9,0 9.9,0.6 8.64,1.86 8.64,3.17 8.79,3.32 11.53,3.32 11.68,3.17 11.68,1.35 12.32,0.71 12.32,0
VIN1  (via drill 0.3 pad 0.4, 0.6 pad 1)
  Top 0.152: C1.1 v16.51,3.11 | C3.1 19.55,3.06 | 19.56,3.06 19.75,3.06 19.86,3.17 R1.2 | 19.56,3.06 19.39,3.23 19.28,3.23 | 19.56,3.06 19.55,3.06 | 19.55,3.06 19.3,2.82 | IC2.12 IC2.13
  other vias: 17.02,3.11 17.53,3.11 18.03,3.11 18.54,3.11 19.05,3.11 18.1,0 19.37,0
  pour Bottom (no thermals): 17.52,0 17.52,0.6 16.26,1.87 16.26,3.22 16.4,3.36 19.15,3.36 19.3,3.22 19.3,1.35 19.94,0.71 19.94,0
  pour Top (no thermals): 16.06,2.71 16.06,3.41 17.5,3.41 18.71,4.62 19.46,4.62 19.51,4.56 19.51,2.71
  pour Route2 (no thermals): 17.52,0 17.52,0.59 16.26,1.86 16.26,3.22 16.4,3.36 19.15,3.36 19.3,3.22 19.3,1.35 19.94,0.71 19.94,0
VOUT0  (via drill 0.3 pad 0.4)
  Top 0.152: IC1.8 IC1.7 | R9.2 v13.34,12.32
  Route3 0.152: v13.34,12.32 13.26,12.32 12.34,11.4 12.34,9.23 C24.1
  Route14 0.152: C24.1 13.62,7.95 13.62,3.34 R14.1
  other vias: 12.7,2.41 7.44,8.65 7.94,8.65 7.69,9.1 8.2,9.1 8.45,8.65 8.71,9.1 12.95,8.62
  pour Top (no thermals): 11.84,6.82 11.84,7.27 12.84,8.27 13.4,8.27 13.4,9.52 7.75,9.52 7.18,8.95 7.18,8.45 8.33,7.31 10.6,7.31 11.09,6.82
VOUT1  (via drill 0.3 pad 0.4)
  Top 0.152: IC2.8 IC2.7
  Route14 0.152: C8.1 21.24,7.95 21.24,3.34 R4.1 | R16.2 11.21,10.89 15.02,10.89 15.82,10.09 15.82,9.72 v15.82,9.1
  other vias: 10.79,11.3 20.32,2.41 15.06,8.65 15.56,8.65 15.31,9.1 16.07,8.65 16.33,9.1 20.57,8.62
  pour Top (no thermals): 19.46,6.82 19.46,7.27 20.46,8.27 21.02,8.27 21.02,9.52 15.37,9.52 14.8,8.95 14.8,8.45 15.95,7.31 18.22,7.31 18.71,6.82
VOUT_0  (via drill 0.3 pad 0.4)
  other vias: 6.66,8.65 6.66,9.16 6.22,8.91 6.22,9.42
  pour Top (no thermals): 6.86,8.4 6.37,8.4 5.97,8.8 5.97,11.06 6.2,11.3 7.9,11.3 7.9,10.3 6.7,10.3 6.5,10.1 6.5,9.68 6.91,9.27 6.91,8.45
VOUT_1  (via drill 0.3 pad 0.4)
  other vias: 14.28,8.65 14.28,9.16 13.84,8.91 13.84,9.42
  pour Top (no thermals): 14.48,8.4 13.99,8.4 13.59,8.8 13.59,11.08 13.81,11.3 15.51,11.3 15.51,10.3 14.3,10.3 14.11,10.1 14.11,9.69 14.53,9.27 14.53,8.45

### Text on the board
tPlace: OUT0 | OUT1